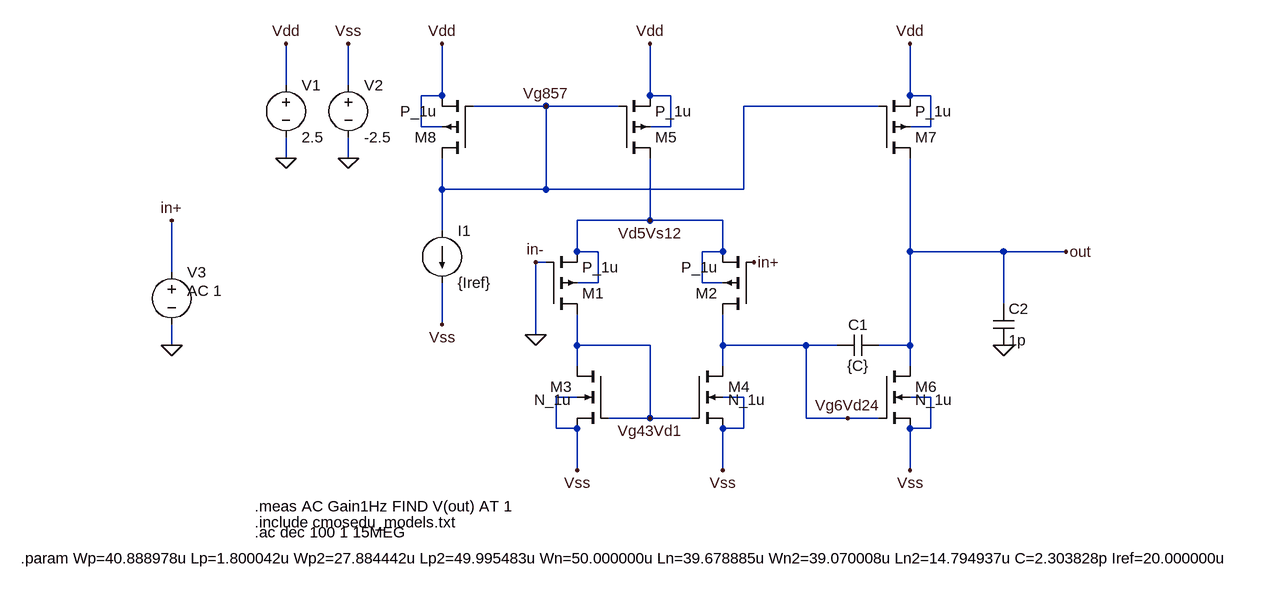
[diagram p0: schematic inicial.asc]
inicial.asc, the LTspice schematic file:
Version 4
SHEET 1 1384 680
WIRE -288 -80 -288 -144
WIRE -192 -80 -192 -144
WIRE -48 -64 -48 -144
WIRE -48 -64 -80 -64
WIRE 272 -64 272 -144
WIRE 304 -64 272 -64
WIRE 672 -64 672 -144
WIRE 704 -64 672 -64
WIRE 112 -48 0 -48
WIRE 224 -48 112 -48
WIRE 624 -48 416 -48
WIRE -80 -16 -80 -64
WIRE -48 -16 -80 -16
WIRE 304 -16 304 -64
WIRE 304 -16 272 -16
WIRE 704 -16 704 -64
WIRE 704 -16 672 -16
WIRE -288 32 -288 0
WIRE -192 32 -192 0
WIRE -48 80 -48 32
WIRE 112 80 112 -48
WIRE 112 80 -48 80
WIRE 416 80 416 -48
WIRE 416 80 112 80
WIRE 208 128 160 128
WIRE 272 128 272 32
WIRE 272 128 208 128
WIRE 304 128 272 128
WIRE 384 128 304 128
WIRE -48 144 -48 80
WIRE 160 176 160 128
WIRE 192 176 160 176
WIRE 384 176 384 128
WIRE 384 176 352 176
WIRE 672 176 672 32
WIRE 816 176 672 176
WIRE 912 176 816 176
WIRE 112 192 96 192
WIRE -464 208 -464 128
WIRE 192 224 192 176
WIRE 192 224 160 224
WIRE 352 224 352 176
WIRE 384 224 352 224
WIRE 816 256 816 176
WIRE -48 288 -48 224
WIRE 160 288 160 272
WIRE 96 304 96 192
WIRE -464 320 -464 288
WIRE 160 320 160 288
WIRE 224 320 160 320
WIRE 272 320 224 320
WIRE 384 320 384 272
WIRE 512 320 384 320
WIRE 560 320 512 320
WIRE 672 320 672 176
WIRE 672 320 624 320
WIRE 160 352 160 320
WIRE 384 352 384 320
WIRE 672 352 672 320
WIRE 160 400 128 400
WIRE 416 400 384 400
WIRE 704 400 672 400
WIRE 272 432 272 320
WIRE 272 432 208 432
WIRE 336 432 272 432
WIRE 512 432 512 320
WIRE 576 432 512 432
WIRE 624 432 576 432
WIRE 128 448 128 400
WIRE 160 448 128 448
WIRE 416 448 416 400
WIRE 416 448 384 448
WIRE 704 448 704 400
WIRE 704 448 672 448
WIRE 160 512 160 448
WIRE 384 512 384 448
WIRE 672 512 672 448
FLAG -48 -144 Vdd
FLAG 272 -144 Vdd
FLAG 672 -144 Vdd
FLAG 96 192 in-
FLAG -48 288 Vss
FLAG 384 512 Vss
FLAG 672 512 Vss
FLAG 160 512 Vss
FLAG -288 32 0
FLAG -192 32 0
FLAG -288 -144 Vdd
FLAG -192 -144 Vss
FLAG -464 128 in+
FLAG -464 320 0
FLAG 816 320 0
FLAG 912 176 out
FLAG 96 304 0
FLAG 432 192 in+
FLAG 112 -48 Vg857
FLAG 272 432 Vg43Vd1
FLAG 576 432 Vg6Vd24
FLAG 272 128 Vd5Vs12
DATAFLAG 304 128 ""
DATAFLAG 208 128 ""
DATAFLAG 160 288 ""
DATAFLAG 224 320 ""
SYMBOL current -48 144 R0
WINDOW 123 0 0 Left 2
WINDOW 39 0 0 Left 2
SYMATTR InstName I1
SYMATTR Value {Iref}
SYMBOL nmos4 208 352 M0
WINDOW 3 56 52 Left 2
SYMATTR Value N_1u
SYMATTR InstName M3
SYMATTR Value2 l={Ln} w={Wn}
SYMBOL cap 560 304 M90
WINDOW 0 0 32 VBottom 2
WINDOW 3 32 32 VTop 2
SYMATTR InstName C1
SYMATTR Value {C}
SYMBOL voltage -288 -96 R0
WINDOW 123 24 44 Left 2
WINDOW 39 0 0 Left 2
SYMATTR InstName V1
SYMATTR Value 2.5
SYMBOL voltage -192 -96 R0
WINDOW 123 24 44 Left 2
WINDOW 39 0 0 Left 2
SYMATTR InstName V2
SYMATTR Value -2.5
SYMBOL voltage -464 192 R0
WINDOW 123 24 44 Left 2
WINDOW 39 0 0 Left 2
WINDOW 3 24 44 Left 2
SYMATTR Value2 AC 1
SYMATTR Value ""
SYMATTR InstName V3
SYMBOL cap 800 256 R0
SYMATTR InstName C2
SYMATTR Value 1p
SYMBOL pmos4 112 272 M180
SYMATTR InstName M1
SYMATTR Value2 l={Lp2} w={Wp2}
SYMATTR Value P_1u
SYMBOL nmos4 336 352 R0
WINDOW 3 56 52 Left 2
SYMATTR Value N_1u
SYMATTR InstName M4
SYMATTR Value2 l={Ln} w={Wn}
SYMBOL nmos4 624 352 R0
WINDOW 3 56 52 Left 2
SYMATTR Value N_1u
SYMATTR InstName M6
SYMATTR Value2 l={Ln2} w={Wn2}
SYMBOL pmos4 432 272 R180
SYMATTR InstName M2
SYMATTR Value2 l={Lp2} w={Wp2}
SYMATTR Value P_1u
SYMBOL pmos4 624 32 M180
SYMATTR InstName M7
SYMATTR Value2 l={Lp} w={Wp}
SYMATTR Value P_1u
SYMBOL pmos4 224 32 M180
SYMATTR InstName M5
SYMATTR Value2 l={Lp} w={Wp}
SYMATTR Value P_1u
SYMBOL pmos4 0 32 R180
SYMATTR InstName M8
SYMATTR Value2 l={Lp} w={Wp}
SYMATTR Value P_1u
TEXT -336 608 Left 2 !.ac dec 100 1 15MEG
TEXT -336 592 Left 2 !.include cmosedu_models.txt
TEXT -336 568 Left 2 !.meas AC Gain1Hz FIND V(out) AT 1
TEXT -696 648 Left 2 !.param Wp=40.888978u Lp=1.800042u Wp2=27.884442u Lp2=49.995483u Wn=50.000000u Ln=39.678885u Wn2=39.070008u Ln2=14.794937u C=2.303828p Iref=20.000000u

The netlist it stands for:
* inicial.asc
I1 Vg857 Vss {Iref}
M3 Vg43Vd1 Vg43Vd1 Vss Vss N_1u l={Ln} w={Wn}
C1 Vg6Vd24 out {C}
V1 Vdd 0 2.5
V2 Vss 0 -2.5
V3 in+ 0 AC 1
C2 out 0 1p
M1 Vg43Vd1 0 Vd5Vs12 Vd5Vs12 P_1u l={Lp2} w={Wp2}
M4 Vg6Vd24 Vg43Vd1 Vss Vss N_1u l={Ln} w={Wn}
M6 out Vg6Vd24 Vss Vss N_1u l={Ln2} w={Wn2}
M2 Vg6Vd24 in+ Vd5Vs12 Vd5Vs12 P_1u l={Lp2} w={Wp2}
M7 out Vg857 Vdd Vdd P_1u l={Lp} w={Wp}
M5 Vd5Vs12 Vg857 Vdd Vdd P_1u l={Lp} w={Wp}
M8 Vg857 Vg857 Vdd Vdd P_1u l={Lp} w={Wp}
.model NMOS NMOS
.model PMOS PMOS
.lib standard.mos
.ac dec 100 1 15MEG
.include cmosedu_models.txt
.meas AC Gain1Hz FIND V(out) AT 1
.param Wp=40.888978u Lp=1.800042u Wp2=27.884442u Lp2=49.995483u Wn=50.000000u Ln=39.678885u Wn2=39.070008u Ln2=14.794937u C=2.303828p Iref=20.000000u
.backanno
.end

* Results of the author's LTspice run, read from the files saved beside the schematic
* Operating Point, zero values left out:
*   V(vg857) = 1.412 V
*   V(vss) = -2.5 V
*   V(vg43vd1) = -1.3 V
*   V(vg6vd24) = -1.3 V
*   V(out) = -1.543 V
*   V(vdd) = 2.5 V
*   V(vd5vs12) = 1.979 V
*   Id(M8) = -20 µA
*   Ib(M8) = 1.098 pA
*   Is(M8) = 20 µA
*   Id(M5) = -19.83 µA
*   Is(M5) = 19.83 µA
*   Id(M7) = -20.83 µA
*   Ib(M7) = 4.053 pA
*   Is(M7) = 20.83 µA
*   Id(M2) = -9.913 µA
*   Ib(M2) = 3.289 pA
*   Is(M2) = 9.913 µA
*   Id(M1) = -9.913 µA
*   Ib(M1) = 3.289 pA
*   Is(M1) = 9.913 µA
*   Id(M6) = 20.83 µA
*   Is(M6) = -20.83 µA
*   Id(M4) = 9.913 µA
*   Ib(M4) = -1.21 pA
*   Is(M4) = -9.913 µA
*   Id(M3) = 9.913 µA
*   Ib(M3) = -1.21 pA
*   Is(M3) = -9.913 µA
*   I(I1) = 20 µA
*   I(V2) = 60.66 µA
*   I(V1) = -60.66 µA
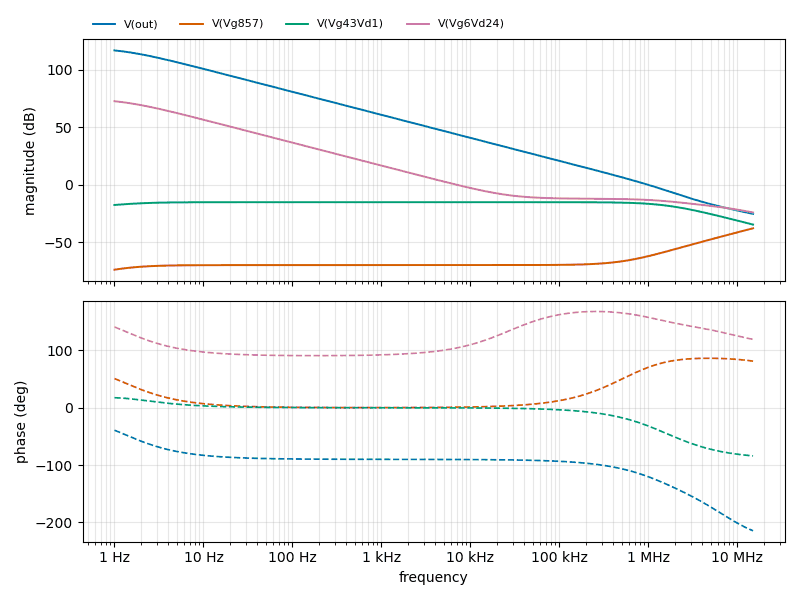
[diagram p1: AC Analysis of inicial.asc, plotted from the saved traces]
* AC Analysis, 1 run:
*   V(out): 116.80 dB at 1 Hz, -25.36 dB at 15 MHz, peak 116.80 dB at 1 Hz, 3 dB below the peak at 1.873 Hz
*   V(Vg857): -73.89 dB at 1 Hz, -37.87 dB at 15 MHz, peak -37.87 dB at 15 MHz, 3 dB below the peak at 10.61 MHz
*   V(Vg43Vd1): -17.61 dB at 1 Hz, -34.68 dB at 15 MHz, peak -15.18 dB at 1.288 kHz, 3 dB below the peak at 1.608 MHz
*   V(Vg6Vd24): 72.60 dB at 1 Hz, -24.12 dB at 15 MHz, peak 72.60 dB at 1 Hz, 3 dB below the peak at 1.873 Hz
* From the log:
*   gain1hz: v(out)=(116.798dB,-39.1557°) at 1